# Altium schematic sheet 7_P6_Gsensor.schdoc
size 307 x 218 mm; Symbol: Sheet-Symbol_A4; Device: Sheet-Symbol_A4; @Project Name: modular_design; @Page Count: 7; @Update Date: 2026-07-07; @Create Date: 2026-07-07; @Schematic Name: Schematic1; @Page No: 7; @Page Name: P6_Gsensor; @Board Name: Board1; Company: 嘉立创EDA; Version: V1.0; Page Size: A4; Convert to PCB: yes; Add into BOM: yes; Title Block Position: 3; Width: 1170; Height: 825; Region Start: 1; X Region Count: 6; Y Region Count: 4; Blade Width: 10; @Create Time: 05:41:33; @Update Time: 13:41:47
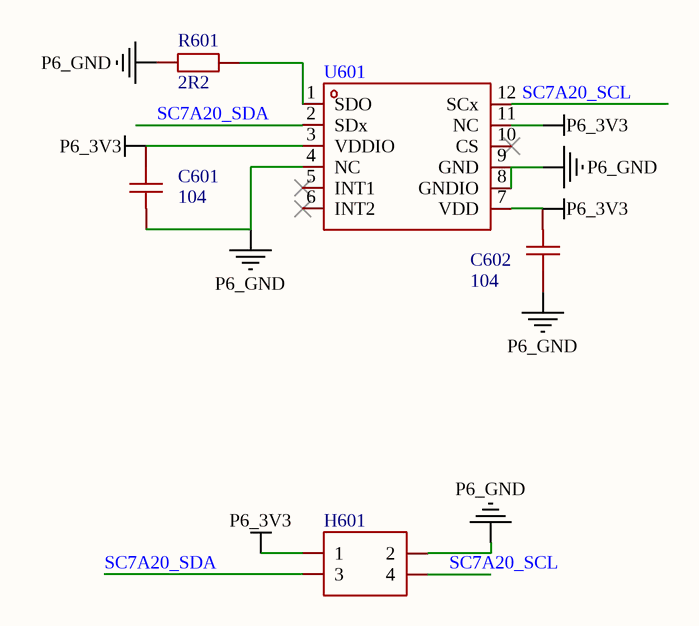
[diagram p0: 7_P6_Gsensor.schdoc]

## Parts
C601  104  [C0603]
C602  104  [C0603]
H601  A2541HWV-2x2P  [Finger_2*2]  (value not drawn)
R601  2R2  [R0603]
U601  (no value)  [LGA-12_L2.0-W2.0-P0.50-TL]

## Nets
P6_3V3: C601.1 C602.2 H601.1 U601.3(VDDIO) U601.7(VDD) U601.11(NC)
P6_GND: C601.2 C602.1 H601.2 R601.1 U601.4(NC) U601.8(GNDIO) U601.9(GND)
SC7A20_SCL: H601.4 U601.12(SCx)
SC7A20_SDA: H601.3 U601.2(SDx)
NetR601_2: R601.2 U601.1(SDO)

Not connected (* = marked no-connect by the designer): U601 5(INT1)* 6(INT2)* 10(CS)*

## Notes on the sheet
- 1
- 2
- 3
- 4
- 5
- 6
- A
- B
- C
- 原理图
- Schematic1
- 创建日期
- 更新日期
- 2026-07-07
- 绘制
- 板子
- Board1
- 图页
- P6_Gsensor
- D
- 审阅
- 版本
- 尺寸
- modular_design
- 页
- 7
- 共
- V1.0
- A4
- 嘉立创EDA

## Library data of the parts
C601 C602 = CGA0603X7R104K500JT: Manufacturer: HRE(芯声); Add into BOM: yes; Tolerance: ±10%; Voltage Rating: 50V; Temperature Coefficient: X7R; Symbol: CGA0603X7R104K500JT; Device: CGA0603X7R104K500JT; LCSC Part Name: 100nF ±10% 50V; Manufacturer Part: CGA0603X7R104K500JT; Supplier Footprint: 0603; JLCPCB Part Class: 扩展库; Datasheet: https://item.szlcsc.com/datasheet/CGA0603X7R104K500JT/7062573.html; Supplier: LCSC; Convert to PCB: yes; Value: 104; Origin Footprint: C0603
H601 = A2541HWV-2x2P: Manufacturer: CJT(长江连接器); Add into BOM: yes; Pitch: 2.54mm; Number of Holes: 4; Holes Structure: 2x2P; Symbol: A2541HWV-2X2P; Device: A2541HWV-2x2P; LCSC Part Name: 2.54mm 2x2P; Supplier Part: C239342; Manufacturer Part: A2541HWV-2x2P; Supplier Footprint: 直插,P=2.54mm; JLCPCB Part Class: Extended Part; Datasheet: https://atta.szlcsc.com/upload/public/pdf/source/20180724/C239342_948074203011CE30B776F48EA8B1A8F2.pdf; Supplier: LCSC; Convert to PCB: yes; Number of Rows: 2; Row Spacing: 2.54mm; Mounting Type: 直插; Insulation Height: -; Contact Material: 黄铜; Contact Plating: 金
R601 = Res_0603: Convert to PCB: yes; Value: 10K; Symbol: Res_0603; Device: Res_0603; Add into BOM: yes; Supplier Footprint: 0603; Origin Footprint: R0603
U601 = SC7A20HTR: Add into BOM: yes; Symbol: SC7A20HTR; Device: SC7A20HTR; Convert to PCB: yes